# EAGLE schematic ADE7756 board (EAGLE 6.2)
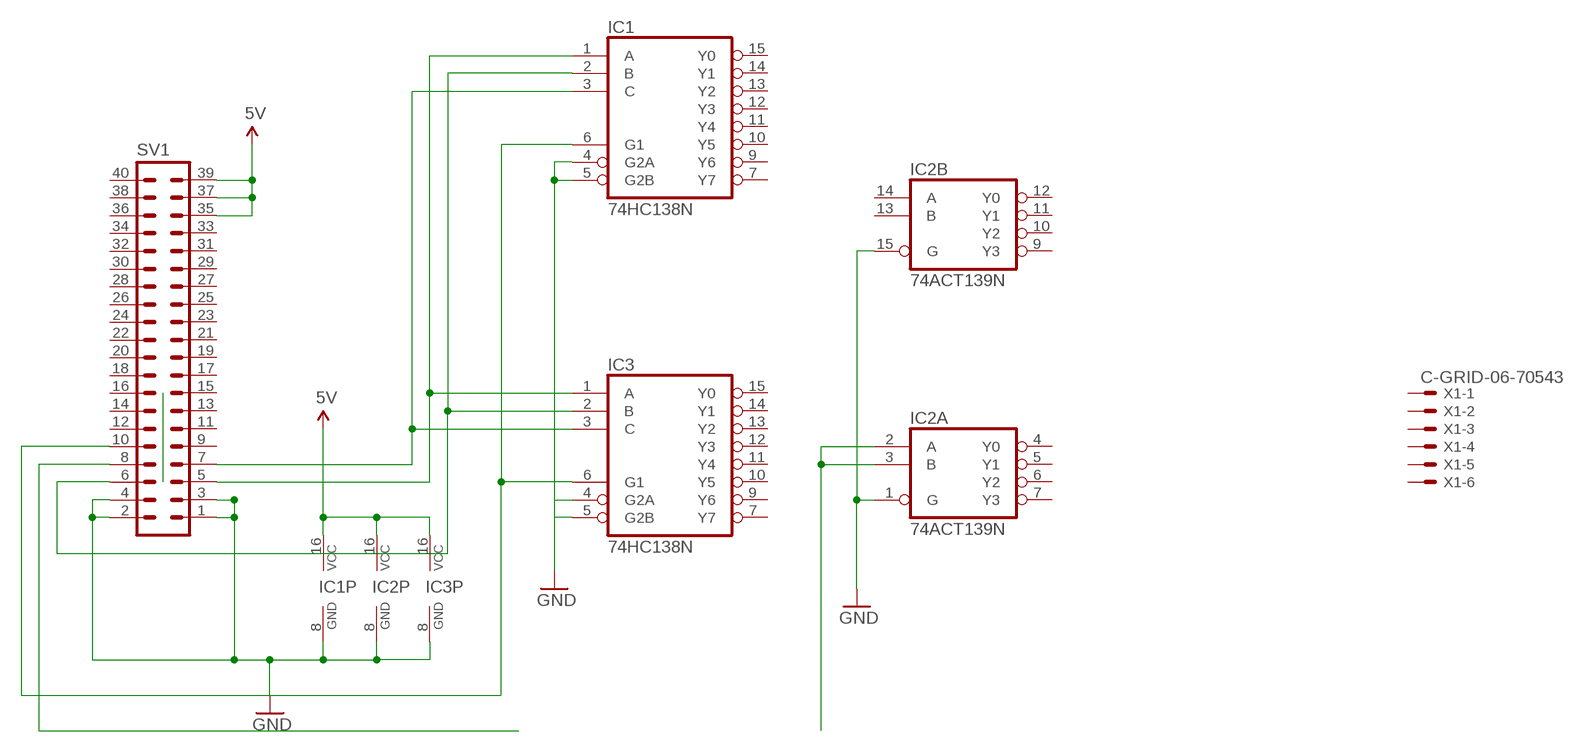
[diagram p0: schematic, sheet 1]

## Parts
IC1  74HC138N  [DIL16]
IC2  74ACT139N  [DIL16]
IC3  74HC138N  [DIL16]
SV1  ML40  [ML40]
X1  C-GRID-06-70543  [70543-06]

## Nets
5V: IC1.16(VCC) IC2.16(P:VCC) IC3.16(VCC) SV1.35 SV1.37 SV1.39
GND: IC1.4(G2A) IC1.5(G2B) IC1.8(GND) IC2.1(A:G) IC2.8(P:GND) IC2.15(B:G) IC3.4(G2A) IC3.5(G2B) IC3.8(GND) SV1.1 SV1.2 SV1.3 SV1.4
N$2: IC1.6(G1) IC3.6(G1) SV1.10
N$3: IC2.2(A:A) IC2.3(A:B)
N$4: IC1.1(A) IC3.1(A) SV1.5
N$5: IC1.2(B) IC3.2(B) SV1.6
N$6: IC1.3(C) IC3.3(C) SV1.7
N$7: SV1.8
Unconnected: IC1.7(Y7) IC1.9(Y6) IC1.10(Y5) IC1.11(Y4) IC1.12(Y3) IC1.13(Y2) IC1.14(Y1) IC1.15(Y0) IC2.4(A:Y0) IC2.5(A:Y1) IC2.6(A:Y2) IC2.7(A:Y3) IC2.9(B:Y3) IC2.10(B:Y2) IC2.11(B:Y1) IC2.12(B:Y0) IC2.13(B:B) IC2.14(B:A) IC3.7(Y7) IC3.9(Y6) IC3.10(Y5) IC3.11(Y4) IC3.12(Y3) IC3.13(Y2) IC3.14(Y1) IC3.15(Y0) SV1.9 SV1.11 SV1.12 SV1.13 SV1.14 SV1.15 SV1.16 SV1.17 SV1.18 SV1.19 SV1.20 SV1.21 SV1.22 SV1.23 SV1.24 SV1.25 SV1.26 SV1.27 SV1.28 SV1.29 SV1.30 SV1.31 SV1.32 SV1.33 SV1.34 SV1.36 SV1.38 SV1.40 X1.1 X1.2 X1.3 X1.4 X1.5 X1.6

## Library data of the parts
IC1 IC3 = 74xx-eu:74*138: 3-line to 8-line DECODER/DEMULTIPLEXER
IC2 = 74xx-eu:74*139: Dual 2-line to 4-line DECODER/DEMULTIPLEXER
SV1 = con-ml:ML40: HARTING; OC_FARNELL: unknown; OC_NEWARK: unknown
X1 = con-molex:C-GRID-06: CONNECTOR wire to board 2.54 mm (0.100") pitch header; OC_FARNELL: unknown; OC_NEWARK: unknown